# EAGLE design wt12_uart_breakout_board_v12 (EAGLE 6.0)
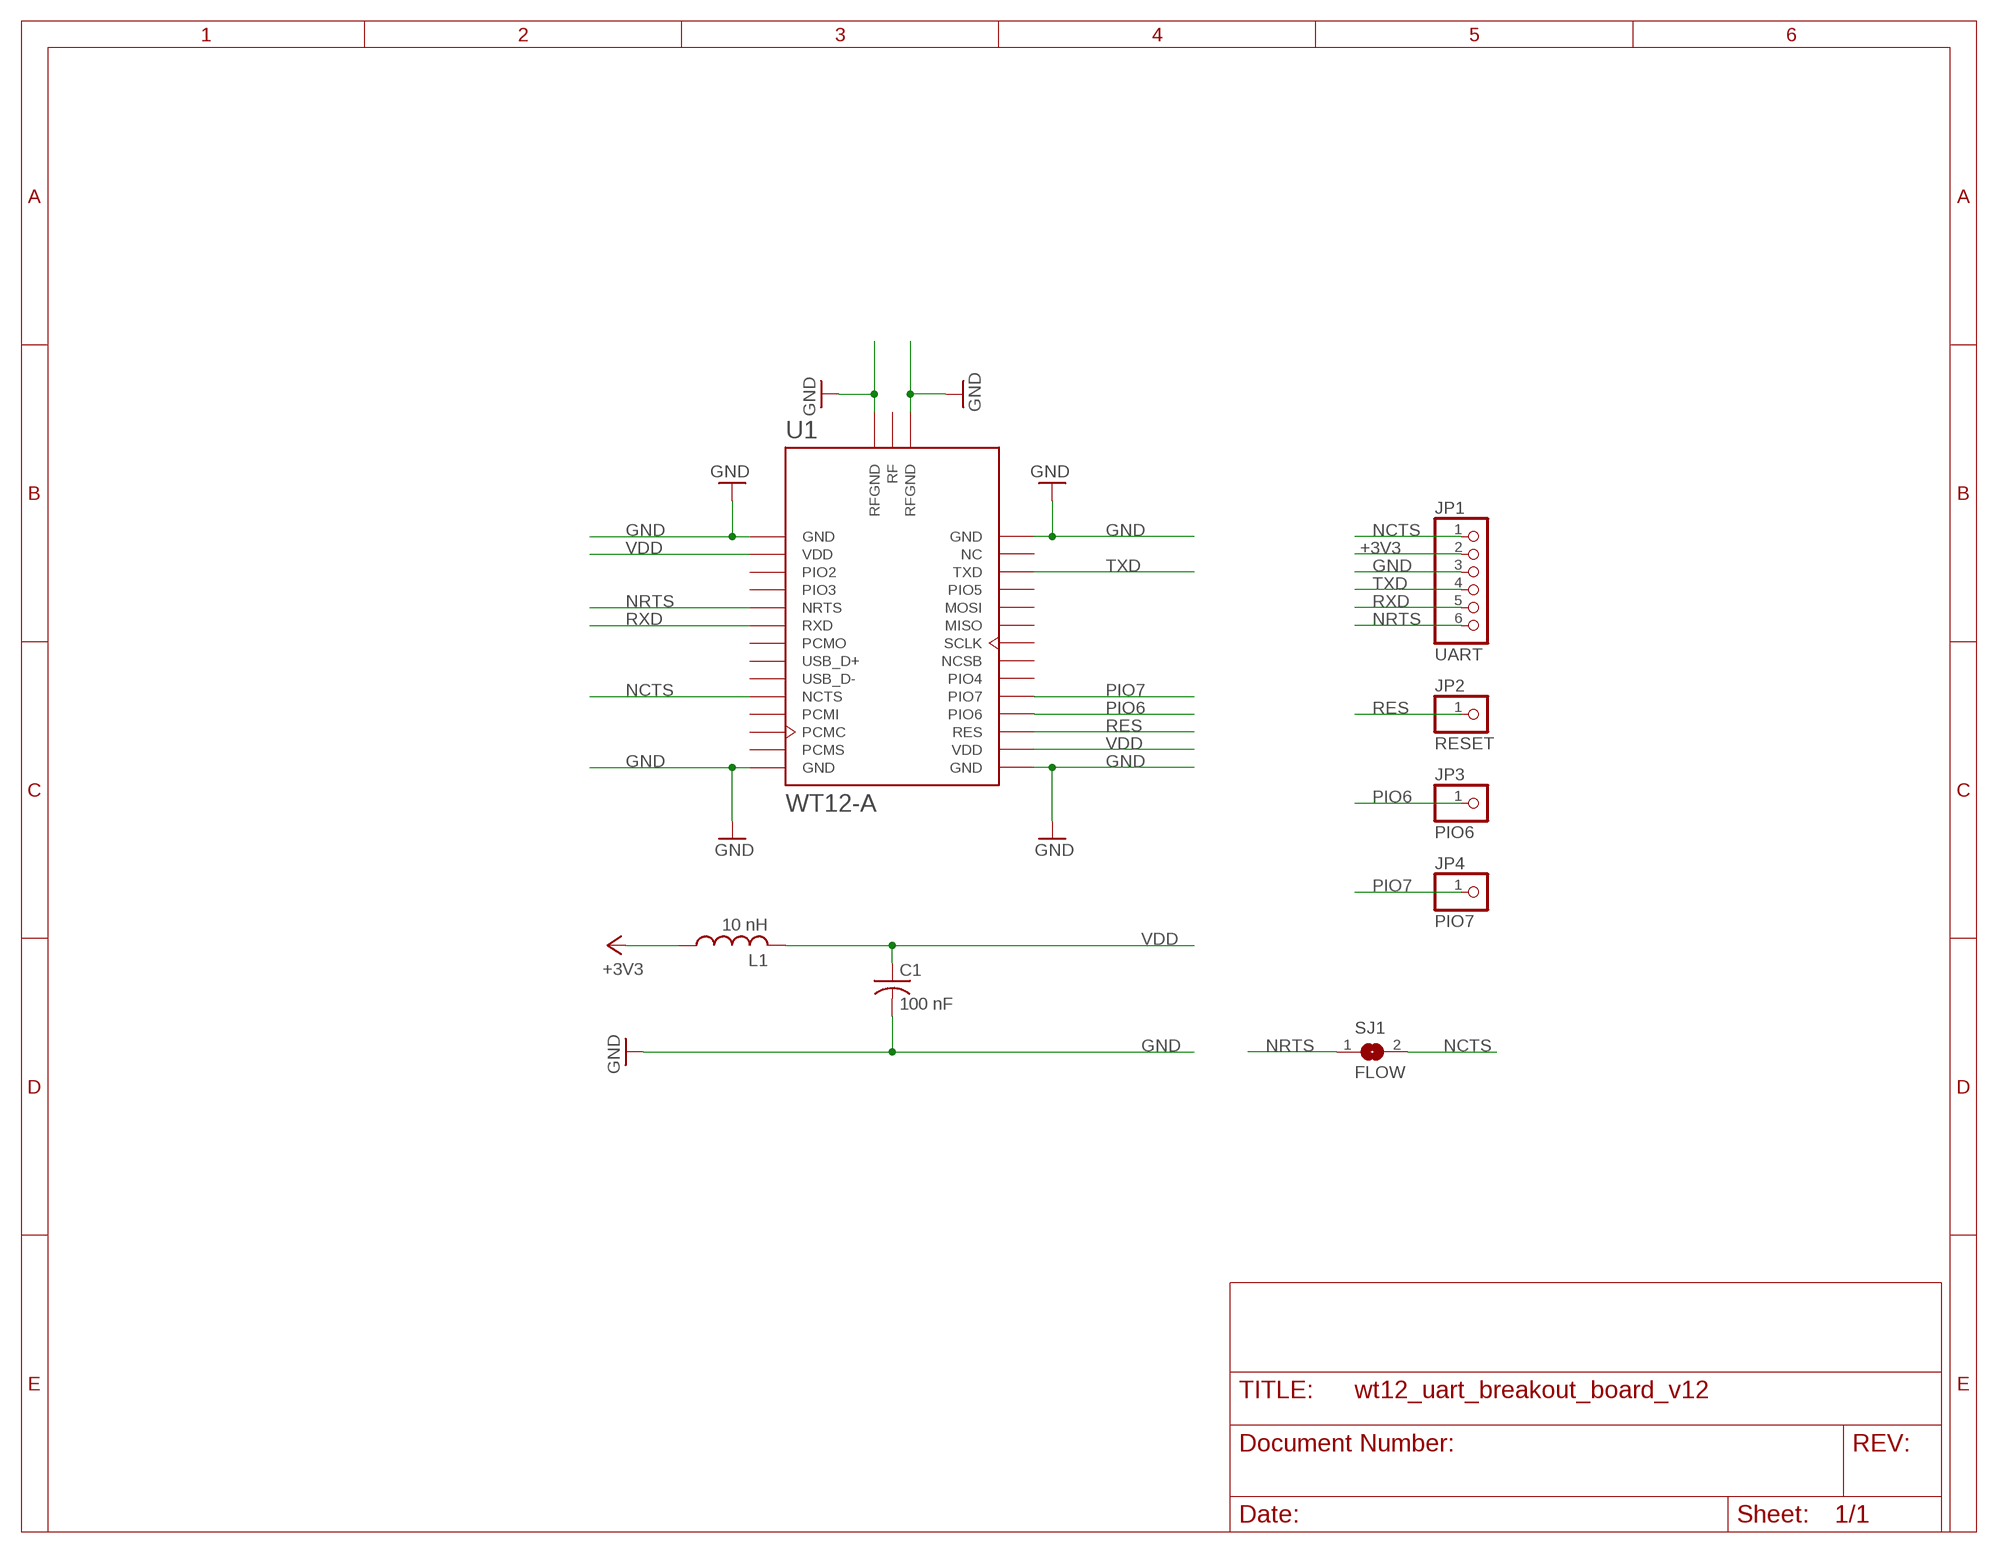
[diagram p0: schematic, sheet 1]

## Parts
C1  100 nF  C-USC0603K  [C0603K]
JP1  UART  PINHD-1X6  [1X06]
JP2  RESET  PINHD-1X1  [1X01]
JP3  PIO6  PINHD-1X1  [1X01]
JP4  PIO7  PINHD-1X1  [1X01]
L1  10 nH  L-USL2012C  [L2012C]
SJ1  FLOW  SJ  [SJ]
U1  WT12-A  WT12-A-VISUAL  [WT12-A]

## Nets
+3V3: JP1.2 L1.1
GND: C1.2 JP1.3 U1.GND1(GND) U1.GND2(GND) U1.GND3(GND) U1.GND4(GND) U1.RFGND1(RFGND) U1.RFGND2(RFGND)
NCTS: JP1.1 SJ1.2 U1.NCTS
NRTS: JP1.6 SJ1.1 U1.NRTS
PIO6: JP3.1 U1.PIO6
PIO7: JP4.1 U1.PIO7
RES: JP2.1 U1.RES
RXD: JP1.5 U1.RXD
TXD: JP1.4 U1.TXD
VDD: C1.1 L1.2 U1.VDD1(VDD) U1.VDD2(VDD)
Unconnected: U1.MISO U1.MOSI U1.NC U1.NCSB U1.PCMC U1.PCMI U1.PCMO U1.PCMS U1.PIO2 U1.PIO3 U1.PIO4 U1.PIO5 U1.RF U1.SCLK U1.USB_D+ U1.USB_D-

## Library data of the parts
C1 = resistor:C-US: CAPACITOR, American symbol
JP1 = sf-pinhead:PINHD-1X6: PIN HEADER
JP2-JP4 = sf-pinhead:PINHD-1X1: PIN HEADER
L1 = resistor:L-US: INDUCTOR, American symbol
SJ1 = jumper:SJ: SMD solder JUMPER
U1 = sf-bluegiga:WT12-A-VISUAL: Class 2 Bluetooth 2.1 + EDR module, chip antenna and RF pins

## Net classes
0 default: width 0.254 mm, drill 0.508 mm, clearance 0.254 mm

## Board
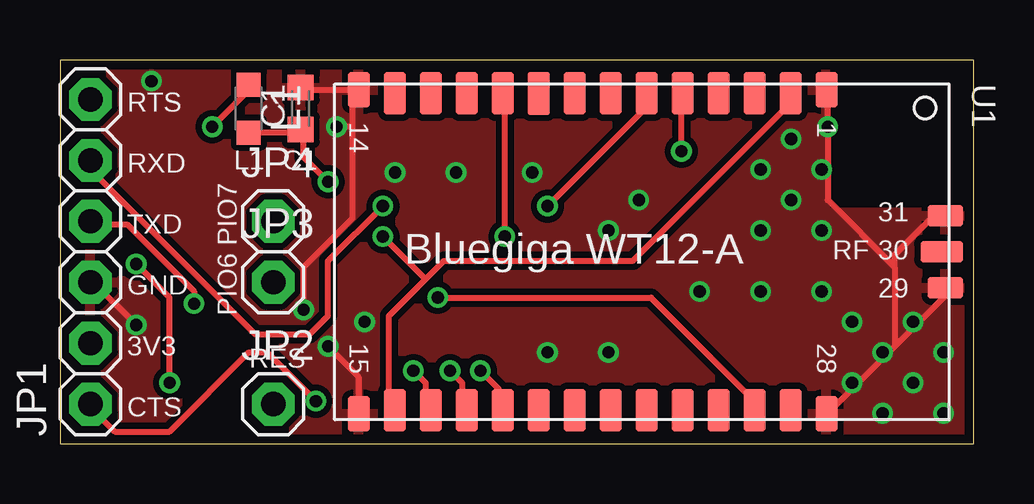
[diagram p1: board, top side]
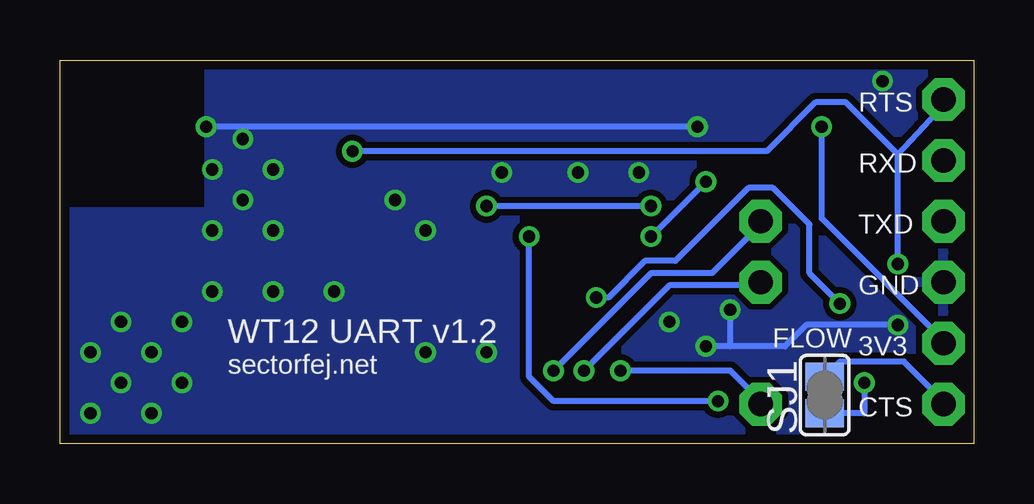
[diagram p2: board, bottom side, seen from below]

Size 38.1 x 15.99 mm. Coordinates in mm from the lower left corner, seen from the top.
Outline: 0,0 38.1,0 38.1,15.99 0,15.99 0,0
Copper layers (1*16): Top 0.0356mm / dielectric 1.5011mm / Bottom 0.0356mm
Design rules: minimum track width 6mil, minimum drill 13mil, track to track 6mil, track to pad 6mil, pad to pad 6mil, via to via 6mil, smd to smd 6mil, copper to edge 15mil, drill to drill 6mil, minimum pad ring 7mil, minimum via ring 7mil, stop-mask expansion 4mil, vias tented up to drill 20mil, thermal gap 10mil
tRestrict: area 32.5,10 to 38.5,16.4
bRestrict: area 32.5,10 to 38.5,16.4

### Footprints (pad centres in the part's own frame; a part is rotated, then mirrored left to right if it is on the bottom)
C0603K = smd 1.05 x 1.08: 1 -0.875,0; 2 0.875,0
1X06 = drill 1.016 pad 1.778 octagon: 1 -6.35,0; 2 -3.81,0; 3 -1.27,0; 4 1.27,0; 5 3.81,0; 6 6.35,0
1X01 = drill 1.016 pad 1.778 octagon: 1 0,0
L2012C = smd 1 x 1: 1 -1,0; 2 1,0
SJ = smd 1.168 x 1.6: 1 -0.762,0; 2 0.762,0
WT12-A = smd 1.478 x 0.914: GND1 -6.75,7.7; GND2 -6.75,-11.8; GND3 6.75,-11.8; GND4 6.75,7.7 | smd 1.778 x 0.914: MISO 6.6,0.2; MOSI 6.6,1.7; NC 6.6,6.2; NCSB 6.6,-2.8; NCTS -6.6,-5.8; NRTS -6.6,1.7; PCMC -6.6,-8.8; PCMI -6.6,-7.3; PCMO -6.6,-1.3; PCMS -6.6,-10.3; PIO2 -6.6,4.7; PIO3 -6.6,3.2; PIO4 6.6,-4.3; PIO5 6.6,3.2; PIO6 6.6,-7.3; PIO7 6.6,-5.8; RES 6.6,-8.8; RXD -6.6,0.2; SCLK 6.6,-1.3; TXD 6.6,4.7; USB_D+ -6.6,-2.8; USB_D- -6.6,-4.3; VDD1 -6.6,6.2; VDD2 6.6,-10.3 | smd 0.914 x 1.778: RF 0,12.5 | smd 0.914 x 1.478: RFGND1 1.5,12.65; RFGND2 -1.5,12.65

### Placement (x,y rotation side)
C1  10.03,13.97 90 top
JP1  1.27,8 90 top
JP2  8.89,1.65 0 top
JP3  8.89,6.73 0 top
JP4  8.89,9.27 0 top
L1  7.87,13.97 270 top
SJ1  6.22,2.03 90 bottom
U1  24.26,8 270 top

### Tracks (layer width: path | path; a pad name or v marks a point on that pad's centre or on a via)
+3V3  (via drill 0.51)
  Top 0.254: v6.35,13.21 7.87,14.73 L1.1
  Bottom 0.254: v6.35,13.21 6.35,9.4 1.27,4.32 JP1.2
GND  (via drill 0.51)
  Top 0.254: 34.8,4.06 37.08,6.35 U1.RFGND1 | 34.8,4.06 32,1.27 U1.GND4 | 34.8,7.37 34.8,4.06 | 34.8,7.37 34.8,7.87 36.32,9.4 36.83,9.4 U1.RFGND2 | 34.8,7.37 32,10.16 v32,13.21 32,14.73 U1.GND1 | 12.19,14.73 10.16,14.73 C1.2 | 12.19,14.73 12.45,14.73 U1.GND2 12.19,14.73 | v11.18,4.06 12.45,2.79 12.45,1.27 U1.GND3 | v3.17,4.95 1.27,6.86 JP1.3 | 12.19,13.21 12.19,9.4 10.16,7.37 v10.16,5.59 | 12.19,13.21 12.19,14.73 | 12.19,13.21 v11.53,13.21
  Bottom 0.254: 10.16,4.06 7.87,4.06 6.99,4.95 v3.17,4.95 | 10.16,4.06 v11.18,4.06 | 10.16,4.06 v10.16,5.59 | v11.53,13.21 v32,13.21
  other vias: 30.48,12.7 31.75,11.43 29.21,11.43 30.48,10.16 29.21,8.89 31.75,8.89 31.75,6.35 29.21,6.35 26.67,6.35 33.02,2.54 12.7,5.08 3.81,15.11 33.02,5.08 34.29,3.81 35.56,5.08 36.83,3.81 35.56,2.54 34.29,1.27 36.83,1.27 13.97,11.3 16.51,11.3 24.13,10.16 22.86,8.89 20.32,3.81 22.86,3.81 19.68,11.3
  pour Bottom: 0,16 31.88,16 31.88,9.65 38.1,9.65 38.1,0 0,0
  pour Top: 0,16 31.88,16 31.88,9.65 38.1,9.65 38.1,0 0,0
NCTS  (via drill 0.51)
  Top 0.254: v18.54,8.64 18.54,14.48 U1.NCTS | v10.67,1.78 8.64,3.81 7.87,3.81 4.57,0.51 2.29,0.51 1.27,1.52 JP1.1
  Bottom 0.254: SJ1.2 5.59,3.43 2.92,3.43 1.27,1.78 JP1.1 | v18.54,8.64 18.54,2.79 17.53,1.78 v10.67,1.78
NRTS  (via drill 0.51)
  Top 0.254: v4.57,2.54 4.57,6.1 v3.17,7.49 | v25.91,12.19 25.91,14.48 U1.NRTS
  Bottom 0.254: v4.57,2.54 4.57,1.27 SJ1.1 | v3.17,7.49 3.17,12.06 | 3.17,12.06 1.27,14.1 JP1.6 | v25.91,12.19 8.64,12.19 6.6,14.22 5.33,14.22 3.17,12.06
PIO6  (via drill 0.51)
  Top 0.254: v16.26,3.05 16.76,2.54 16.76,1.52 U1.PIO6
  Bottom 0.254: v16.26,3.05 12.7,6.6 8.89,6.6 JP3.1
PIO7  (via drill 0.51)
  Top 0.254: v17.53,3.05 18.29,2.29 18.29,1.52 U1.PIO7
  Bottom 0.254: v17.53,3.05 13.46,7.11 10.92,7.11 8.89,9.14 JP4.1
RES  (via drill 0.51)
  Top 0.254: v14.73,3.05 15.24,2.54 15.24,1.52 U1.RES
  Bottom 0.254: v14.73,3.05 10.16,3.05 8.89,1.78 JP2.1
RXD  (via drill 0.51)
  Top 0.254: v20.32,9.91 24.38,13.97 24.38,14.48 U1.RXD | v13.46,9.91 11.18,7.62 11.18,5.33 10.41,4.57 8.13,4.57 1.27,11.43 JP1.5
  Bottom 0.254: v13.46,9.91 v20.32,9.91
TXD  (via drill 0.51)
  Top 0.254: v15.75,6.1 24.64,6.1 28.96,1.78 28.96,1.52 U1.TXD | v5.59,5.84 5.59,6.35 2.79,9.14 1.27,9.14 JP1.4
  Bottom 0.254: v15.75,6.1 15.24,6.1 13.72,7.62 12.45,7.62 9.4,10.67 8.38,10.67 6.86,9.14 6.86,7.11 v5.59,5.84
VDD  (via drill 0.51)
  Top 0.254: L1.2 7.87,12.95 9.91,12.95 C1.1 10.16,12.95 10.16,11.94 v11.18,10.92 | 15.24,6.86 16,7.62 23.88,7.62 30.23,13.97 30.23,14.48 U1.VDD1 | 15.24,6.86 13.72,5.33 13.72,1.52 U1.VDD2 | 15.24,6.86 v13.46,8.64
  Bottom 0.254: v13.46,8.64 v11.18,10.92

### Text on the board
tPlace: RTS | RXD | L1 | C1 | TXD | PIO7 | Bluegiga WT12-A | GND | PIO6 | 3V3 | RES | CTS
bPlace: RTS | RXD | TXD | GND | FLOW | 3V3 | WT12 UART v1.2 | sectorfej.net | CTS